# Altium project MB1397.PrjPcb (part 7 of 9)

## Sheet STLink_V3E_SWD.SchDoc: ST-LINK V3 SWD Module
size A3; Date: Not used; ApprovedBy: Not used; CheckedBy: Not used; Author: Not used; CompanyName: STMicroelectronics; DrawnBy: Not used; Engineer: Not used; Organization: Not used; Address1: Not used; Address2: Not used; Address3: Not used; Address4: Not used; DocumentNumber: Not used; Revision: Not used; SheetNumber: 21; SheetTotal: 22; CurrentTime: Not used; CurrentDate: Not used; Time: Not used; DocumentFullPathAndName: Not used; DocumentName: Not used; ModifiedDate: Not used; ImagePath: Not used; ProjectName: Not used; Application_BuildNumber: Not used
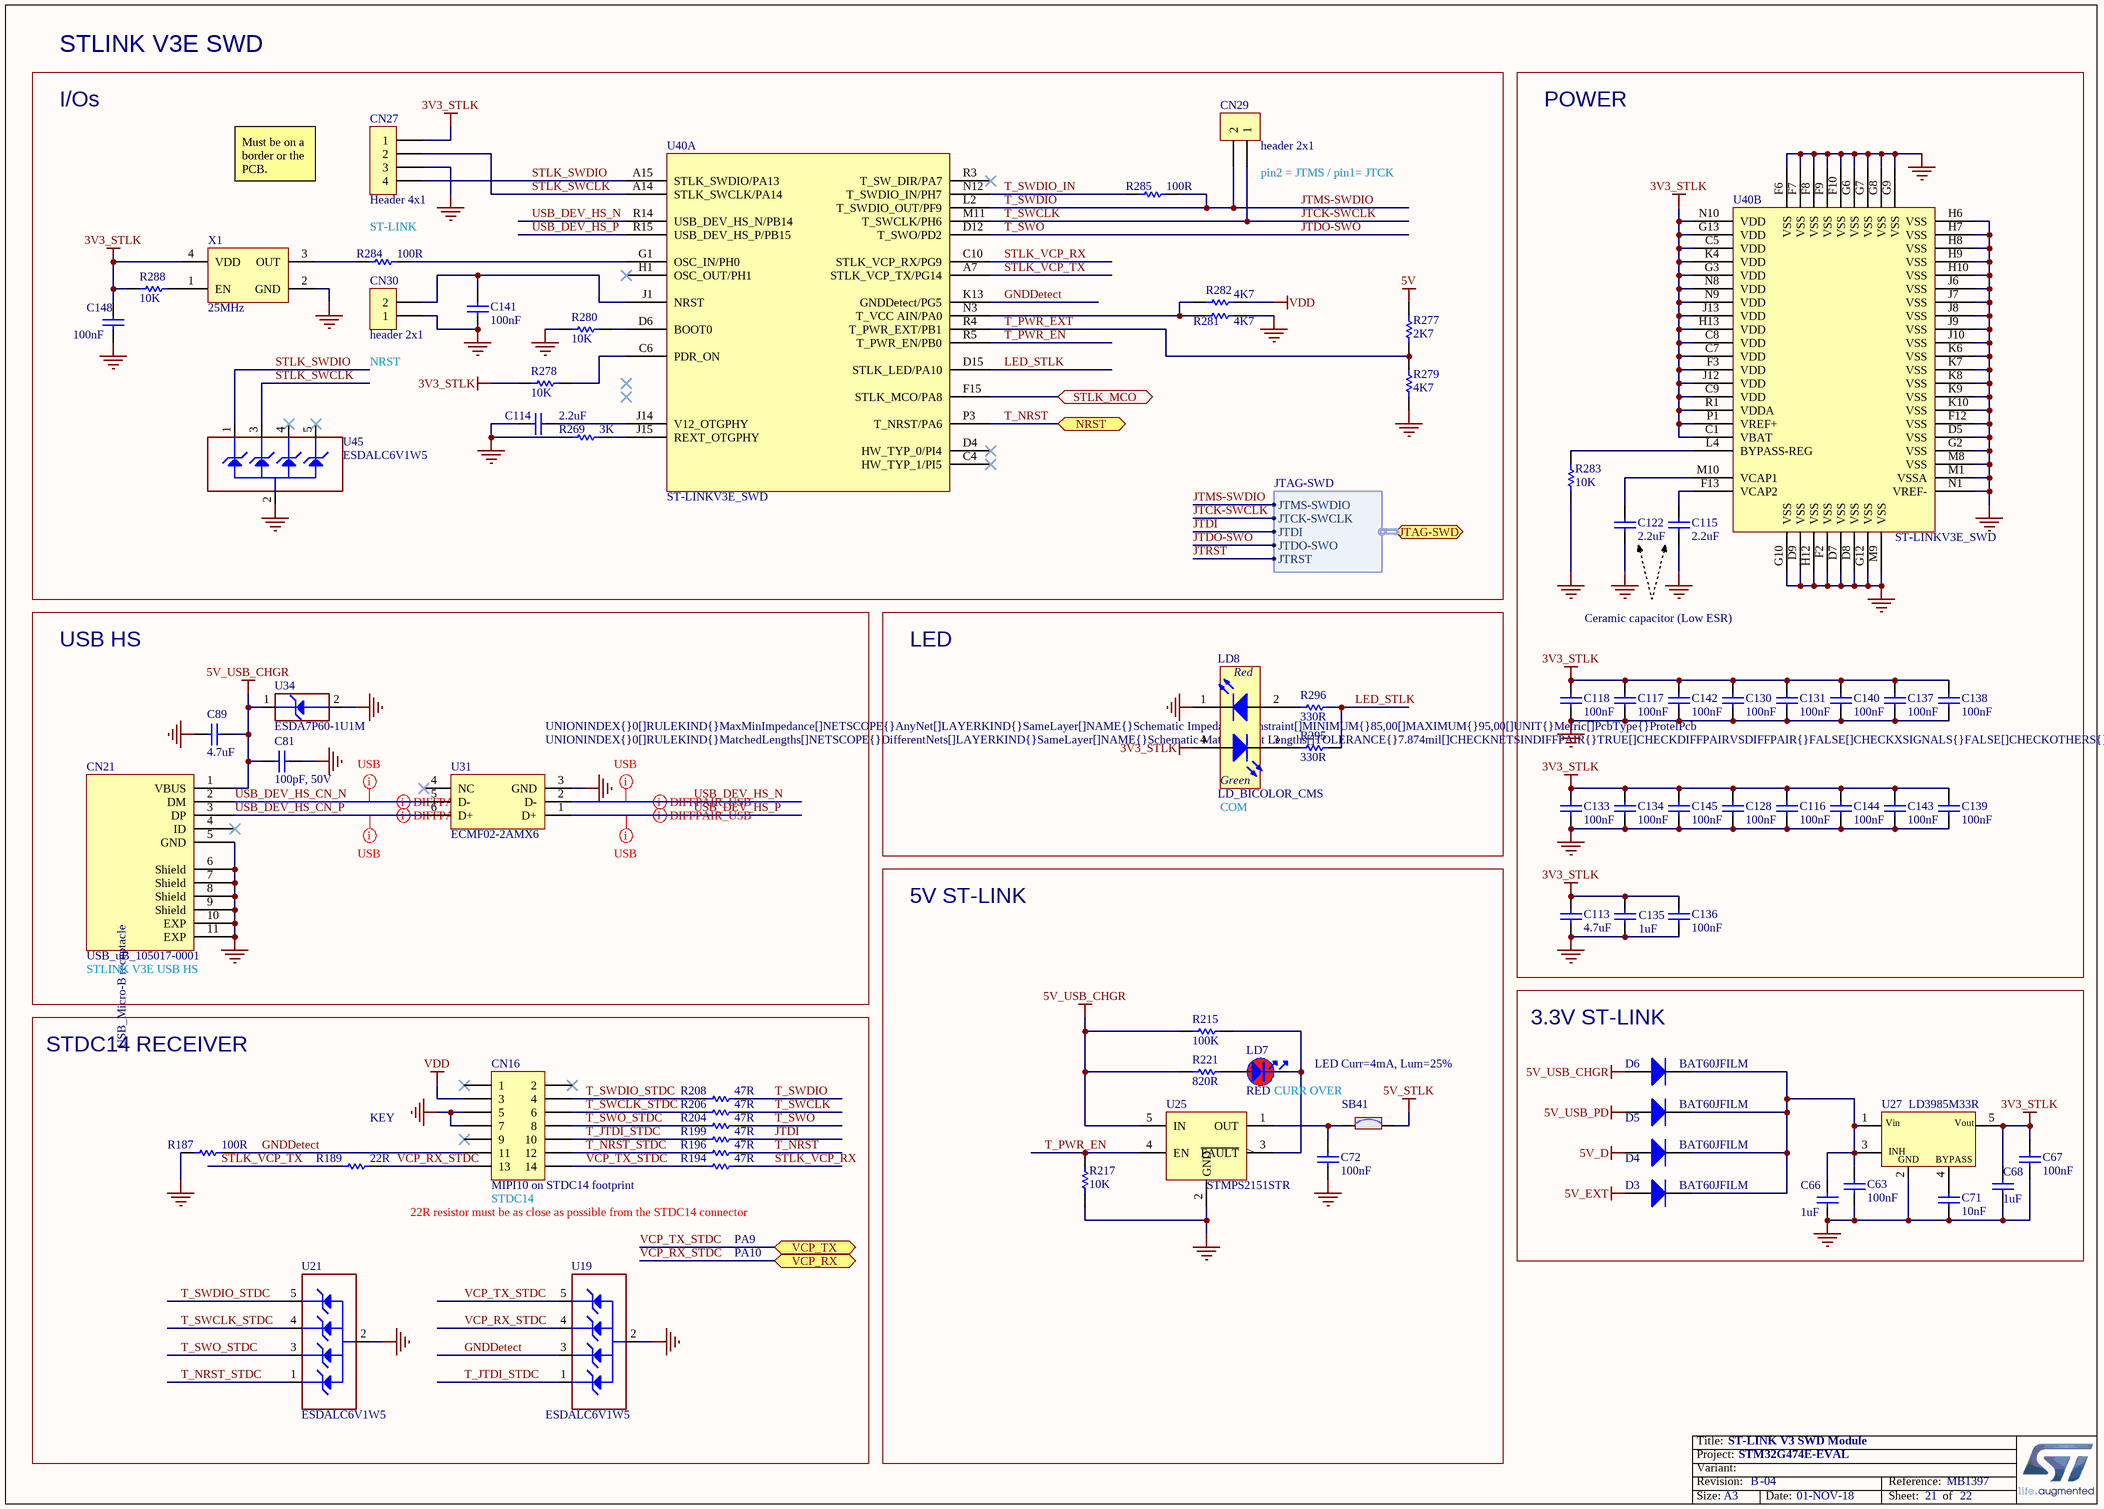
[diagram p16: STLink_V3E_SWD.SchDoc]

### Parts
C63  value 100nF  [C0402]  (hidden comment: Capacitor)
C66  value 1uF  [C0603]  (hidden comment: Capacitor)
C67  value 100nF  [C0603]  (hidden comment: Capacitor)
C68  value 1uF  [C0603]  (hidden comment: Capacitor)
C71  value 10nF  [C0402]  (hidden comment: Capacitor)
C72  value 100nF  [C0402]  (hidden comment: Capacitor)
C81  value 100pF, 50V  [C0603]  (hidden comment: Capacitor)
C89  value 4.7uF  [C0603]  (hidden comment: Capacitor)
C113  value 4.7uF  [C0603]  (hidden comment: Capacitor)
C114  value 2.2uF  [C0603]  (hidden comment: Capacitor)
C115  value 2.2uF  [C1206_H1P15]  (hidden comment: Capacitor)
C116  value 100nF  [C0402]  (hidden comment: Capacitor)
C117  value 100nF  [C0402]  (hidden comment: Capacitor)
C118  value 100nF  [C0402]  (hidden comment: Capacitor)
C122  value 2.2uF  [C1206_H1P15]  (hidden comment: Capacitor)
C128  value 100nF  [C0402]  (hidden comment: Capacitor)
C130  value 100nF  [C0402]  (hidden comment: Capacitor)
C131  value 100nF  [C0402]  (hidden comment: Capacitor)
C133  value 100nF  [C0402]  (hidden comment: Capacitor)
C134  value 100nF  [C0402]  (hidden comment: Capacitor)
C135  value 1uF  [C0603]  (hidden comment: Capacitor)
C136  value 100nF  [C0402]  (hidden comment: Capacitor)
C137  value 100nF  [C0402]  (hidden comment: Capacitor)
C138  value 100nF  [C0402]  (hidden comment: Capacitor)
C139  value 100nF  [C0402]  (hidden comment: Capacitor)
C140  value 100nF  [C0402]  (hidden comment: Capacitor)
C141  value 100nF  [C0402]  (hidden comment: Capacitor)
C142  value 100nF  [C0402]  (hidden comment: Capacitor)
C143  value 100nF  [C0402]  (hidden comment: Capacitor)
C144  value 100nF  [C0402]  (hidden comment: Capacitor)
C145  value 100nF  [C0402]  (hidden comment: Capacitor)
C148  value 100nF  [C0402]  (hidden comment: Capacitor)
CN16  value MIPI10 on STDC14 footprint  [CON_STDC14_Receiver_MEDIUM_WITH_MIPI10_3D]  (hidden comment: Header 7x2)
CN21  value USB_uB_105017-0001  [CON_USBMICROB_MOLEX_105017-0001_H2P90]  (hidden comment: USB_uB_105017.0001)
CN27  Header 4x1  [CON_SAMTEC_TSW-104-07-G-S]
CN29  Header 2x1  [CON_988-JIUBABA_PHFS25-11-02-G0B115-T-1]
CN30  Header 2x1  [CON_988-JIUBABA_PHFS25-11-02-G0B115-T-1]
D3  BAT60JFILM  [DIO_SOD323]
D4  BAT60JFILM  [DIO_SOD323]
D5  BAT60JFILM  [DIO_SOD323]
D6  BAT60JFILM  [DIO_SOD323]
LD7  value RED  [LED_0603_VISHAY_VLMS1300-GS08_RED_1A2K_H0P8]  (hidden comment: LED_red)
LD8  LD_BICOLOR_CMS  [LED_BI-GR_HSMF-A201-A00J1]
R187  value 100R  [R0402]  (hidden comment: Resistor)
R189  value 22R  [R0402]  (hidden comment: Resistor)
R194  value 47R  [R0402]  (hidden comment: Resistor)
R196  value 47R  [R0402]  (hidden comment: Resistor)
R199  value 47R  [R0402]  (hidden comment: Resistor)
R204  value 47R  [R0402]  (hidden comment: Resistor)
R206  value 47R  [R0402]  (hidden comment: Resistor)
R208  value 47R  [R0402]  (hidden comment: Resistor)
R215  value 100K  [R0603]  (hidden comment: Resistor)
R217  value 10K  [R0402]  (hidden comment: Resistor)
R221  value 820R  [R0402]  (hidden comment: Resistor)
R269  value 3K  [R0402]  (hidden comment: Resistor)
R277  value 2K7  [R0402]  (hidden comment: Resistor)
R278  value 10K  [R0402]  (hidden comment: Resistor)
R279  value 4K7  [R0402]  (hidden comment: Resistor)
R280  value 10K  [R0402]  (hidden comment: Resistor)
R281  value 4K7  [R0402]  (hidden comment: Resistor)
R282  value 4K7  [R0402]  (hidden comment: Resistor)
R283  value 10K  [R0402]  (hidden comment: Resistor)
R284  value 100R  [R0402]  (hidden comment: Resistor)
R285  value 100R  [R0402]  (hidden comment: Resistor)
R288  value 10K  [R0402]  (hidden comment: Resistor)
R295  value 330R  [R0603]  (hidden comment: Resistor)
R296  value 330R  [R0603]  (hidden comment: Resistor)
SB41  SB_ON  [SOLDER-BRIDGE_R0603-0R]  (value not drawn)
U19  ESDALC6V1W5  [ESD_SOT323-5L]
U21  ESDALC6V1W5  [ESD_SOT323-5L]
U25  STMPS2151STR  [MOS_SOT23-5L]
U27  LD3985M33R  [REG_SOT23-5L]
U31  ECMF02-2AMX6  [ESD_QFN-6L_1P7X1P5_P050]
U34  value ESDA7P60-1U1M  [ESD_QFN2_1P6X1_P125]  (hidden comment: ESD-TRANSIL)
U40  ST-LINKV3E_SWD  [ICC_UFBGA201_176+25_10X10_P065]  (parts A,B of 2)
U45  ESDALC6V1W5  [ESD_SOT323-5L]
X1  value 25MHz  [OSC_NDK_NZ2520SB_4P]  (hidden comment: OSCILLATOR_4_PINS)

### Blocks framed on the sheet
STLINK V3E SWD: C114 C141 C148 CN27 CN29 CN30 R269 R277-R282 R284 R285 R288 U40 U45 X1
POWER: C113 C115-C118 C122 C128 C130 C131 C133-C140 C142-C145 R283 U40
USB HS: C81 C89 CN21 U31 U34
LED: LD8 R295 R296
5V ST-LINK: C72 LD7 R215 R217 R221 SB41 U25
3.3V ST-LINK: C63 C66-C68 C71 D3-D6 U27
STDC14 RECEIVER: CN16 R187 R189 R194 R196 R199 R204 R206 R208 U19 U21

### Ports
JTAG-SWD (harness JTAG-SWD), NRST, STLK_MCO, VCP_RX, VCP_TX

### Harnesses
JTAG-SWD: JTMS-SWDIO, JTCK-SWCLK, JTDI, JTDO-SWO, JTRST

### Nets
3V3_STLK: C67.2 C68.2 C113.2 C116.2 C117.2 C118.2 C128.2 C130.2 C131.2 C133.2 C134.2 C135.2 C136.2 C137.2 C138.2 C139.2 C140.2 C142.2 C143.2 C144.2 C145.2 C148.2 CN27.1 LD8.4(YellowGreen_anode) R278.1 R288.1 U27.5(Vout) U40.C1(VBAT) U40.C5(VDD) U40.C7(VDD) U40.C8(VDD) U40.C9(VDD) U40.F3(VDD) U40.G3(VDD) U40.G13(VDD) U40.H13(VDD) U40.J12(VDD) U40.J13(VDD) U40.K4(VDD) U40.N8(VDD) U40.N9(VDD) U40.N10(VDD) U40.P1(VREF+) U40.R1(VDDA) X1.4(VDD)
5V: R277.2
5V_D: D4.1(A)
5V_EXT: D3.1(A)
5V_STLK: SB41.2
5V_USB_CHGR: C81.1 C89.2 CN21.1(VBUS) D6.1(A) R215.1 R221.1 U25.5(IN) U34.1(IO1)
5V_USB_PD: D5.1(A)
GND: C63.1 C66.2 C67.1 C68.1 C71.1 C72.1 C81.2 C89.1 C113.1 C114.1 C115.1 C116.1 C117.1 C118.1 C122.1 C128.1 C130.1 C131.1 C133.1 C134.1 C135.1 C136.1 C137.1 C138.1 C139.1 C140.1 C141.1 C142.1 C143.1 C144.1 C145.1 C148.1 CN16.5 CN16.7 CN21.5(GND) CN21.6(Shield) CN21.7(Shield) CN21.8(Shield) CN21.9(Shield) CN21.10(EXP) CN21.11(EXP) CN27.3 CN30.1 LD8.1(RED_cathode) R187.1 R217.1 R269.1 R279.1 R280.1 R281.2 R283.1 U19.2(GND) U21.2(GND) U25.2(GND) U27.2(GND) U31.3(GND) U34.2(GND) U40.D5(VSS) U40.D7(VSS) U40.D8(VSS) U40.D9(VSS) U40.F2(VSS) U40.F6(VSS) U40.F7(VSS) U40.F8(VSS) U40.F9(VSS) U40.F10(VSS) U40.F12(VSS) U40.G2(VSS) U40.G6(VSS) U40.G7(VSS) U40.G8(VSS) U40.G9(VSS) U40.G10(VSS) U40.G12(VSS) U40.H6(VSS) U40.H7(VSS) U40.H8(VSS) U40.H9(VSS) U40.H10(VSS) U40.H12(VSS) U40.J6(VSS) U40.J7(VSS) U40.J8(VSS) U40.J9(VSS) U40.J10(VSS) U40.K6(VSS) U40.K7(VSS) U40.K8(VSS) U40.K9(VSS) U40.K10(VSS) U40.M1(VSSA) U40.M8(VSS) U40.M9(VSS) U40.N1(VREF-) U45.2(GND) X1.2(GND)
VDD: CN16.3 R282.2
GNDDetect: CN16.11 R187.2 U19.3(IO2) U40.K13(GNDDetect/PG5)
JTCK-SWCLK: CN29.1 R206.2 U40.M11(T_SWCLK/PH6) ; port JTAG-SWD.JTCK-SWCLK  [also labelled T_SWCLK]
JTDI: R199.2 ; port JTAG-SWD.JTDI
JTDO-SWO: R204.2 U40.D12(T_SWO/PD2) ; port JTAG-SWD.JTDO-SWO  [also labelled T_SWO]
JTMS-SWDIO: CN29.2 R208.2 R285.2 U40.L2(T_SWDIO_OUT/PF9) ; port JTAG-SWD.JTMS-SWDIO  [also labelled T_SWDIO]
LED_STLK: R295.2 R296.2 U40.D15(STLK_LED/PA10)
STLK_SWCLK: CN27.2 U40.A14(STLK_SWCLK/PA14) U45.3(IO2)
STLK_SWDIO: CN27.4 U40.A15(STLK_SWDIO/PA13) U45.1(IO1)
STLK_VCP_RX: R194.2 U40.C10(STLK_VCP_RX/PG9)
STLK_VCP_TX: R189.1 U40.A7(STLK_VCP_TX/PG14)
T_JTDI_STDC: CN16.10 R199.1 U19.1(IO1)
T_NRST: R196.2 U40.P3(T_NRST/PA6) ; port NRST  [project net NRST]
T_NRST_STDC: CN16.12 R196.1 U21.1(IO1)
T_PWR_EN: R217.2 U25.4(EN) U40.R5(T_PWR_EN/PB0)
T_PWR_EXT: R277.1 R279.2 U40.R4(T_PWR_EXT/PB1)
T_SWCLK_STDC: CN16.6 R206.1 U21.4(IO3)
T_SWDIO_IN: R285.1 U40.N12(T_SWDIO_IN/PH7)
T_SWDIO_STDC: CN16.4 R208.1 U21.5(IO4)
T_SWO_STDC: CN16.8 R204.1 U21.3(IO2)
USB_DEV_HS_CN_N: CN21.2(DM) U31.5(D-)
USB_DEV_HS_CN_P: CN21.3(DP) U31.6(D+)
USB_DEV_HS_N: U31.2(D-) U40.R14(USB_DEV_HS_N/PB14)
USB_DEV_HS_P: U31.1(D+) U40.R15(USB_DEV_HS_P/PB15)
VCP_RX_STDC: CN16.13 R189.2 U19.4(IO3) ; port VCP_RX
VCP_TX_STDC: CN16.14 R194.1 U19.5(IO4) ; port VCP_TX
NetC63_2: C63.2 C66.1 D3.2(K) D4.2(K) D5.2(K) D6.2(K) U27.1(Vin) U27.3(CE)
NetC71_2: C71.2 U27.4(BYPASS)
NetC72_2: C72.2 SB41.1 U25.1(OUT)
NetC114_2: C114.2 U40.J14(V12_OTGPHY)
NetC115_2: C115.2 U40.F13(VCAP2)
NetC122_2: C122.2 U40.M10(VCAP1)
NetC141_2: C141.2 CN30.2 U40.J1(NRST)
NetLD7_1: LD7.1 R221.2
NetLD7_2: LD7.2 R215.2 U25.3(~{FAULT})
NetLD8_2: LD8.2(Red_anode) R296.1
NetLD8_3: LD8.3(YellowGreen_cathode) R295.1
NetR269_2: R269.2 U40.J15(REXT_OTGPHY)
NetR278_2: R278.2 U40.C6(PDR_ON)
NetR280_2: R280.2 U40.D6(BOOT0)
NetR281_1: R281.1 R282.1 U40.N3(T_VCC_AIN/PA0)
NetR283_2: R283.2 U40.L4(BYPASS-REG)
NetR284_1: R284.1 X1.3(OUT)
NetR284_2: R284.2 U40.G1(OSC_IN/PH0)
NetR288_2: R288.2 X1.1(EN)
NetR312_1: U40.F15(STLK_MCO/PA8) ; port STLK_MCO

Not connected (* = marked no-connect by the designer): CN16 1* 2* 9*; CN21 4(ID)*; U31 4(NC)*; U40 C4(HW_TYP_1/PI5)* D4(HW_TYP_0/PI4)* H1(OSC_OUT/PH1)* R3(T_SW_DIR/PA7)*; U45 4(IO3)* 5(IO4)*

### Layout directives
differential pair; rule Impedance Constraint [Min = 85.00    Max = 95.00    ]: USB_DEV_HS_CN_N, USB_DEV_HS_CN_P, USB_DEV_HS_N, USB_DEV_HS_P
rule Undefined; rule Matched Net Lengths [Tolerance = 0.2mm]; rule Impedance Constraint [Min = 85.00    Max = 95.00    ]: USB_DEV_HS_CN_N, USB_DEV_HS_CN_P, USB_DEV_HS_N, USB_DEV_HS_P

### Notes on the sheet
- I/Os
- Must be on a border or the PCB.
- (near CN29) pin2 = JTMS / pin1= JTCK
- ST-LINK
- (near CN30) NRST
- Ceramic capacitor (Low ESR)
- COM
- (near CN21) STLINK V3E USB HS
- (near R189) KEY
- (near LD7) CURR OVER
- LED Curr=4mA, Lum=25%
- 22R resistor must be as close as possible from the STDC14 connector
- (near CN16) STDC14
- PA9
- PA10
- Title:
- Project:
- Size:
- Revision:
- Variant:
- A3
- -
- Date:
- Reference:
- Sheet:
- of
- (in symbol MCD-00028) USB_Micro-B receptacle
- (in symbol MCD-00051) Red; Green
- (in symbol MCD-00086) INH

### Library data of the parts
C63 C72 C116-C118 C128 C130 C131 C133 C134 C136-C145 C148 = MCD-00006: as C157 on sheet Peripherals; Internal_Part_Number: MCD-00006; Status: Released; Package: C0402; ComponentLink1Description: Datasheet; Part_Type: Capacitor; ComponentLink1URL: http://tunmcdsvn.tun.st.com/Component_Datasheet_Library/Trunk/Capacitors/Yageo_Multilayer_Capacitor_X7R_series_100pF_to_22uF
C66 C68 C135 = MCD-00010: as C43 on sheet Peripherals; Internal_Part_Number: MCD-00010; Status: Released; Part_Type: Capacitor; Package: C0603; ComponentLink1Description: Datasheet; ComponentLink1URL: http://tunmcdsvn.tun.st.com/Component_Datasheet_Library/Trunk/Capacitors/Yageo_Multilayer_capacitor_X5R_series_100pF_to_100uF
C67 = MCD-00211: as C13 on sheet Peripherals; Internal_Part_Number: MCD-00211; Status: Released; Package: C0603; ComponentLink1Description: Datasheet; Part_Type: Capacitor; ComponentLink1URL: http://tunmcdsvn.tun.st.com/Component_Datasheet_Library/Trunk/Capacitors/Yageo_Multilayer_Capacitor_X7R_series_100pF_to_22uF
C71 = MCD-00011: Capacitor, MLCC, 10nF, 16V, X7R, 10%, 0402, T=0.5mm; Manufacturer_Part_Number: CC0402KRX7R7BB103; Manufacturer: YAGEO; Provided_By: SUBCO; Initial_Board_Reference: MB1274; Path: ws/MCD_ApplicationBoards/Lists/MCDPARTSdatabase; Item Type: Item; Internal_Part_Number: MCD-00011; Status: Released; Part_Type: Capacitor; Package: C0402; ComponentLink1Description: Datasheet; ComponentLink1URL: http://tunmcdsvn.tun.st.com/Component_Datasheet_Library/Trunk/Capacitors/Yageo_Multilayer_Capacitor_X7R_series_100pF_to_22uF
C81 = MCD-01101: Capacitor,100pF,50V,X7R,10%,0603; Manufacturer_Part_Number: 06035C101JAT4A; Manufacturer: AVX; Provided_By: SUBCO; Initial_Board_Reference: MB1381; Path: ws/MCD_ApplicationBoards/Lists/MCDPARTSdatabase; Item Type: Item; Internal_Part_Number: MCD-01101; Status: Footprint available; Part_Type: Capacitor; Package: C0603; ComponentLink1Description: Datasheet; ComponentLink1URL: http://tunmcdsvn.tun.st.com/Component_Datasheet_Library/Trunk/Capacitors/AVX_Capacitor_X7R-series/AVX_X7R-series.pdf
C89 C113 = MCD-00009: Capacitor, MLCC, 4.7uF, 16V, X5R, 10%, 0603, T=0.8mm; Manufacturer_Part_Number: CC0603KRX5R7BB475; Manufacturer: YAGEO; Provided_By: SUBCO; Initial_Board_Reference: MB1274; Path: ws/MCD_ApplicationBoards/Lists/MCDPARTSdatabase; Item Type: Item; Internal_Part_Number: MCD-00009; Status: Released; Part_Type: Capacitor; Package: C0603; ComponentLink1Description: Datasheet; ComponentLink1URL: http://tunmcdsvn.tun.st.com/Component_Datasheet_Library/Trunk/Capacitors/Yageo_Multilayer_capacitor_X5R_series_100pF_to_100uF
C114 = MCD-00012: Capacitor, MLCC, 2.2uF, 10V, X5R, 10%, 0603, T=0,8mm; Manufacturer_Part_Number: CC0603KRX5R6BB225; Manufacturer: YAGEO; Alternate_Manufacturer_Part_Number: C0603C225K8PACTU; Alternate_Manufacturer: KEMET; Provided_By: SUBCO; Initial_Board_Reference: MB1274; Path: ws/MCD_ApplicationBoards/Lists/MCDPARTSdatabase; Item Type: Item; Internal_Part_Number: MCD-00012; Status: Released; Package: C0603; ComponentLink1Description: Datasheet; Part_Type: Capacitor; ComponentLink1URL: http://tunmcdsvn.tun.st.com/Component_Datasheet_Library/Trunk/Capacitors/Yageo_Multilayer_capacitor_X5R_series_100pF_to_100uF
C115 C122 = MCD-00008: Capacitor, MLCC, 2.2uF, 16V, X7R, 10%, 1206, T=1,15mm; Manufacturer_Part_Number: CC1206KKX7R7BB225; Manufacturer: YAGEO; Alternate_Manufacturer_Part_Number: C1206C225K4RAC; Alternate_Manufacturer: KEMET; Provided_By: SUBCO; Initial_Board_Reference: MB1274; Path: ws/MCD_ApplicationBoards/Lists/MCDPARTSdatabase; Item Type: Item; Internal_Part_Number: MCD-00008; Status: Released; Part_Type: Capacitor; Package: C1206; ComponentLink1Description: Datasheet; ComponentLink1URL: http://tunmcdsvn.tun.st.com/Component_Datasheet_Library/Trunk/Capacitors/Yageo_Multilayer_Capacitor_X7R_series_100pF_to_22uF
CN16 = MCD-01226: Header 5x2, 1.27mm, Dual row, Straight, Surface mount, vertical male connector. 3.05mm lead. Mates with FFSD connector. Footprint compatible with FTSH-107-01-L-DV,-K,-A,-P,-ES (STDC14 MEDIUM); Manufacturer_Part_Number: FTSH-105-01-L-DV-K; Manufacturer: SAMTEC; Provided_By: SUBCO; Initial_Board_Reference: MCD16-052; Path: ws/MCD_ApplicationBoards/Lists/MCDPARTSdatabase; Item Type: Item; Internal_Part_Number: MCD-01226; Status: Released; Part_Type: Connector; ComponentLink1Description: Datasheet; ComponentLink1URL: http://tunmcdsvn.tun.st.com/Component_Datasheet_Library/Trunk/Connectors/Samtec_FTSH_smt_series
CN21 = MCD-00028: USB-MICRO-B, 0.65mm, RA, SMT, Bottom Mount,; Manufacturer_Part_Number: 1050170001; Manufacturer: MOLEX; Part_Type: Connector; Provided_By: SUBCO; Initial_Board_Reference: MB1274; Path: ws/MCD_ApplicationBoards/Lists/MCDPARTSdatabase; Item Type: Item; Internal_Part_Number: MCD-00028; Status: Released; ComponentLink1Description: Datasheet; ComponentLink1URL: http://tunmcdsvn.tun.st.com/Component_Datasheet_Library/Trunk/Connectors/Molex_Connector-USB-microB_105017-0001
CN27 = MCD-00029: Header, 4x1, 2,54mm, VR, TH, Height 5.84mm/2.54mm; Manufacturer_Part_Number: TSW-104-07-x-S; Manufacturer: SAMTEC; Part_Type: Connector; Provided_By: SUBCO; Initial_Board_Reference: MB1274; Path: ws/MCD_ApplicationBoards/Lists/MCDPARTSdatabase; Item Type: Item; Internal_Part_Number: MCD-00029; Value: Header 4x1; Status: Released; ComponentLink1Description: Datasheet; ComponentLink1URL: http://tunmcdsvn.tun.st.com/Component_Datasheet_Library/Trunk/Connectors/Samtec_TSW-HTSW-series
CN29 CN30 = MCD-00314: Header, 2x1, 2.54mm, VR, TH, Height 6mm/3mm; Part_Type: Connector; Manufacturer_Part_Number: PHFS25-11-02-G0B115-T-1; Manufacturer: JIUBABA; Provided_By: SUBCO; Initial_Board_Reference: MB1311; Path: ws/MCD_ApplicationBoards/Lists/MCDPARTSdatabase; Item Type: Item; Internal_Part_Number: MCD-00314; Value: header 2x1; Status: Released; ComponentLink1Description: Datasheet; ComponentLink1URL: http://tunmcdsvn.tun.st.com/Component_Datasheet_Library/Trunk/Connectors/Jiubaba_PHFS25_11XXXXXXXXXX
D3-D6 = MCD-00034: Manufacturer: STMICROELECTRONICS; Part_Type: Diode; BMS_Part_Number: 9151097; Provided_By: SUBCO with ST control; Initial_Board_Reference: MB1274; Path: ws/MCD_ApplicationBoards/Lists/MCDPARTSdatabase; Item Type: Item; Internal_Part_Number: MCD-00034; Value: BAT60JFILM; Status: Released; Manufacturer_Part_Number: BAT60JFILM; ComponentLink1Description: Datasheet; ComponentLink1URL: http://tunmcdsvn.tun.st.com/Component_Datasheet_Library/Trunk/Diodes/STM_Diode_BAT60JFILM-SOD323
LD7 = MCD-00587: as LD3 on sheet Peripherals; Internal_Part_Number: MCD-00587; Status: Released; ComponentLink1Description: Datasheet; ComponentLink1URL: http://tunmcdsvn.tun.st.com/Component_Datasheet_Library/Trunk/Display/VISHAY_LED_RED_VLMS1300-GS08; Order_Code_Digikey: VLMS1300-GS08CT-ND; Order_Code_Farnell: 2078728; Package: LED 0603
LD8 = MCD-00051: LED Bicolor; Part_Type: Display; Manufacturer_Part_Number: HSMF-A201-A00J1; Manufacturer: AVAGO TECHNOLOGIES; Alternate_Manufacturer_Part_Number: LE-RGW35280; Alternate_Manufacturer: EVERLUCK; Provided_By: SUBCO; Initial_Board_Reference: MB1274; Path: ws/MCD_ApplicationBoards/Lists/MCDPARTSdatabase; Item Type: Item; Internal_Part_Number: MCD-00051; Value: LD_BICOLOR_CMS; Status: Released; ComponentLink1Description: Datasheet; ComponentLink1URL: http://tunmcdsvn.tun.st.com/Component_Datasheet_Library/Trunk/Display/Avago_LED-SMC_HSMx-A2xx-02Feb2012
R187 R284 R285 = MCD-00119: Resistor,100R,0402,1%,1/16W; Manufacturer_Part_Number: RC0402FR-07100RL; Manufacturer: YAGEO; Provided_By: SUBCO; Initial_Board_Reference: MB1262; Path: ws/MCD_ApplicationBoards/Lists/MCDPARTSdatabase; Item Type: Item; Internal_Part_Number: MCD-00119; Status: Released; Part_Type: Resistor; ComponentLink1Description: Datasheet; Package: R0402; ComponentLink1URL: http://tunmcdsvn.tun.st.com/Component_Datasheet_Library/Trunk/Resistors/Yageo_Resistor_RC0402-series
R189 = MCD-00189: Resistor,22R,0402,1%,1/16W; Manufacturer_Part_Number: RC0402FR-0722RL; Manufacturer: YAGEO; Provided_By: SUBCO; Initial_Board_Reference: MBxxxx; Path: ws/MCD_ApplicationBoards/Lists/MCDPARTSdatabase; Item Type: Item; Internal_Part_Number: MCD-00189; Status: Released; Part_Type: Resistor; Package: R0402; ComponentLink1Description: Datasheet; ComponentLink1URL: http://tunmcdsvn.tun.st.com/Component_Datasheet_Library/Trunk/Resistors/Yageo_Resistor_RC0402-series
R194 R196 R199 R204 R206 R208 = MCD-00481: Resistor,47R,0402,1%,1/16W; Internal_Part_Number: MCD-00481
R215 = MCD-00223: Resistor,100K,0603,1%,1/10W; Manufacturer_Part_Number: RC0603FR-07100KL; Manufacturer: YAGEO; Provided_By: SUBCO; Initial_Board_Reference: MB1319; Path: ws/MCD_ApplicationBoards/Lists/MCDPARTSdatabase; Item Type: Item; Internal_Part_Number: MCD-00223; Status: Released; Part_Type: Resistor; Package: R0603; ComponentLink1Description: Datasheet; ComponentLink1URL: http://tunmcdsvn.tun.st.com/Component_Datasheet_Library/Trunk/Resistors/Yageo_Resistor_RC0603-series
R217 R278 R280 R283 R288 = MCD-00053: as R294 on sheet Peripherals; Internal_Part_Number: MCD-00053; Status: Released; ComponentLink1Description: Datasheet; Part_Type: Resistor; Package: R0402; ComponentLink1URL: http://tunmcdsvn.tun.st.com/Component_Datasheet_Library/Trunk/Resistors/Yageo_Resistor_RC0402-series
R221 = MCD-00527: Resistor,820R,0402,1%,1/16W; Manufacturer_Part_Number: RC0402FR-07820RL; Manufacturer: YAGEO; Provided_By: SUBCO; Initial_Board_Reference: MBxxxx; Path: ws/MCD_ApplicationBoards/Lists/MCDPARTSdatabase; Item Type: Item; Internal_Part_Number: MCD-00527; Status: Released; Part_Type: Resistor; Package: R0402; ComponentLink1Description: Datasheet; ComponentLink1URL: http://tunmcdsvn.tun.st.com/Component_Datasheet_Library/Trunk/Resistors/Yageo_Resistor_RC0402-series
R269 = MCD-00185: Resistor,3K,0402,1%,1/16W; Manufacturer_Part_Number: RC0402FR-073KL; Manufacturer: YAGEO; Provided_By: SUBCO; Initial_Board_Reference: MBxxxx; Path: ws/MCD_ApplicationBoards/Lists/MCDPARTSdatabase; Item Type: Item; Internal_Part_Number: MCD-00185; Status: Released; ComponentLink1Description: Datasheet; Part_Type: Resistor; Package: R0402; ComponentLink1URL: http://tunmcdsvn.tun.st.com/Component_Datasheet_Library/Trunk/Resistors/Yageo_Resistor_RC0402-series
R277 = MCD-00055: Resistor,2K7,0402,1%,1/16W; Manufacturer_Part_Number: RC0402FR-072K7L; Manufacturer: YAGEO; Provided_By: SUBCO; Initial_Board_Reference: MB1274; Path: ws/MCD_ApplicationBoards/Lists/MCDPARTSdatabase; Item Type: Item; Internal_Part_Number: MCD-00055; Status: Released; ComponentLink1Description: Datasheet; Part_Type: Resistor; Package: R0402; ComponentLink1URL: http://tunmcdsvn.tun.st.com/Component_Datasheet_Library/Trunk/Resistors/Yageo_Resistor_RC0402-series
R279 R281 R282 = MCD-00065: as R16 on sheet Peripherals; Internal_Part_Number: MCD-00065; Status: Released; ComponentLink1Description: Datasheet; Alternate_Manufacturer: YAGEO; Part_Type: Resistor; Package: R0402; ComponentLink1URL: http://tunmcdsvn.tun.st.com/Component_Datasheet_Library/Trunk/Resistors/Yageo_Resistor_RC0402-series
R295 R296 = MCD-00197: Resistor,330R,0603,1%,1/10W; Manufacturer_Part_Number: RC0603FR-07330RL; Manufacturer: YAGEO; BMS_Part_Number: 9129729; Provided_By: SUBCO; Initial_Board_Reference: MBxxxx; Path: ws/MCD_ApplicationBoards/Lists/MCDPARTSdatabase; Item Type: Item; Internal_Part_Number: MCD-00197; Status: Released; ComponentLink1Description: Datasheet; Part_Type: Resistor; Package: R0603; ComponentLink1URL: http://tunmcdsvn.tun.st.com/Component_Datasheet_Library/Trunk/Resistors/Yageo_Resistor_RC0603-series
SB41 = MCD-00071: as SB1 on sheet Peripherals; Internal_Part_Number: MCD-00071; Status: Released; ComponentLink1Description: Datasheet; Package: SB0603; ComponentLink1URL: http://tunmcdsvn.tun.st.com/Component_Datasheet_Library/Trunk/Resistors/Yageo_Resistor_RC0603-series
U19 U21 = MCD-00136: Dual Transil array for ESD protection; Part_Type: Diode; Manufacturer: STMICROELECTRONICS; BMS_Part_Number: 9151112; Provided_By: SUBCO with ST control; Initial_Board_Reference: MB1262; Path: ws/MCD_ApplicationBoards/Lists/MCDPARTSdatabase; Item Type: Item; Internal_Part_Number: MCD-00136; Value: ESDALC6V1W5; Status: Released; Manufacturer_Part_Number: ESDALC6V1W5; ComponentLink1Description: Datasheet; ComponentLink1URL: http://tunmcdsvn.tun.st.com/Component_Datasheet_Library/Trunk/Diodes/STM_ESD_ESDALC6V1W5
U25 = MCD-00159: 500mA, Enhanced single channel power switches with active high enable pin; Part_Type: IC; Manufacturer: STMICROELECTRONICS; Alternate_Manufacturer_Part_Number: TPS2051C; Alternate_Manufacturer: TEXAS INSTRUMENTS; BMS_Part_Number: 9159009; Provided_By: SUBCO with ST control; Initial_Board_Reference: MB1264; Path: ws/MCD_ApplicationBoards/Lists/MCDPARTSdatabase; Item Type: Item; Internal_Part_Number: MCD-00159; Value: STMPS2151STR; Status: Released; Manufacturer_Part_Number: STMPS2151STR; ComponentLink1Description: Datasheet; ComponentLink1URL: http://tunmcdsvn.tun.st.com/Component_Datasheet_Library/Trunk/IC/STM_PWR-Switch_STMPS2151STR
U27 = MCD-00086: Ultra low drop-low noise BiCMOS voltage, regulators low ESR capacitors compatible; Manufacturer: STMICROELECTRONICS; Part_Type: IC; BMS_Part_Number: 9176161; Provided_By: SUBCO with ST control; Initial_Board_Reference: MB1274; Path: ws/MCD_ApplicationBoards/Lists/MCDPARTSdatabase; Item Type: Item; Internal_Part_Number: MCD-00086; Value: LD3985M33R; Status: Released; Manufacturer_Part_Number: LD3985M33R; ComponentLink1Description: Datasheet; ComponentLink1URL: http://tunmcdsvn.tun.st.com/Component_Datasheet_Library/Trunk/IC/STM_LDO_LD3985
U31 = MCD-00649: Common mode filter with ESD protection for USB 2.0 interface; Part_Type: Diode; Manufacturer: STMICROELECTRONICS; BMS_Part_Number: 9151138; Provided_By: SUBCO with ST control; Initial_Board_Reference: MB1248; Path: ws/MCD_ApplicationBoards/Lists/MCDPARTSdatabase; Item Type: Item; Internal_Part_Number: MCD-00649; Value: ECMF02-2AMX6; Status: Released; Manufacturer_Part_Number: ECMF02-2AMX6; ComponentLink1Description: Datasheet; ComponentLink1URL: http://tunmcdsvn.tun.st.com/Component_Datasheet_Library/Trunk/Diodes/STM_ESD_ECMF02-2AMX6
U34 = MCD-00251: High power transient voltage suppressor, 7V breakdown; Part_Type: Diode; Manufacturer: STMICROELECTRONICS; BMS_Part_Number: 9179042; Provided_By: SUBCO with ST control; Initial_Board_Reference: MB1311; Path: ws/MCD_ApplicationBoards/Lists/MCDPARTSdatabase; Item Type: Item; Internal_Part_Number: MCD-00251; Status: Released; Manufacturer_Part_Number: ESDA7P60-1U1M; ComponentLink1Description: Datasheet; ComponentLink1URL: http://tunmcdsvn.tun.st.com/Component_Datasheet_Library/Trunk/Diodes/STM_ESD_ESDA7P60-1U1M
U40 = MCD-00596: STM32F723IEK  (STM32F7) BGA176; Part_Type: IC; Manufacturer_Part_Number: STM32F723IEK6; Manufacturer: STMICROELECTRONICS; BMS_Part_Number: 9175300; Provided_By: SUBCO with ST control; Initial_Board_Reference: MB1331; Path: ws/MCD_ApplicationBoards/Lists/MCDPARTSdatabase; Item Type: Item; Internal_Part_Number: MCD-00596; Value: ST-LINKV3E_SWD; Status: Released; ComponentLink1Description: Datasheet; ComponentLink1URL: http://tunmcdsvn.tun.st.com/Component_Datasheet_Library/Trunk/IC/BGA176+25L_10x10x0.6_pitch0.65
U45 = MCD-00136: Dual Transil array for ESD protection; Manufacturer: STMICROELECTRONICS; Part_Type: Diode; BMS_Part_Number: 9151112; Provided_By: SUBCO with ST control; Initial_Board_Reference: MB1262; Path: ws/MCD_ApplicationBoards/Lists/MCDPARTSdatabase; Item Type: Item; Internal_Part_Number: MCD-00136; Value: ESDALC6V1W5; Manufacturer_Part_Number: ESDALC6V1W5; ComponentLink1Description: Datasheet; Status: Released; ComponentLink1URL: http://tunmcdsvn.tun.st.com/Component_Datasheet_Library/Trunk/Diodes/STM_ESD_ESDALC6V1W5
X1 = MCD-00597: Oscillator 25.00Mhz, -+50PPM, 3.3V, Temp -55 to +125°C; Manufacturer_Part_Number: NZ2520SB 25MHz END4869B; Manufacturer: NDK; Alternate_Manufacturer_Part_Number: KC2520B25.0000C10E00; Alternate_Manufacturer: AVX CORP/KYOCERA CORP; Part_Type: Crystal_Osc; BMS_Part_Number: 9157031; Provided_By: ST; Initial_Board_Reference: MB1331; Path: ws/MCD_ApplicationBoards/Lists/MCDPARTSdatabase; Item Type: Item; Internal_Part_Number: MCD-00597; Status: Released; ComponentLink1Description: Datasheet; ComponentLink1URL: http://tunmcdsvn.tun.st.com/Component_Datasheet_Library/Trunk/Crystal_Osc/NDK_OSCILLATOR_NZ2520SB; Order_Code_Digikey: 478-4780-1-ND

## Sheet ExtensionConnector.SchDoc: Extension Connectors
size A4; Date: Not used; ApprovedBy: Not used; CheckedBy: Not used; Author: Not used; CompanyName: STMicroelectronics; DrawnBy: Not used; Engineer: Not used; Organization: Not used; Address1: Not used; Address2: Not used; Address3: Not used; Address4: Not used; DocumentNumber: Not used; Revision: Not used; SheetNumber: 17; SheetTotal: 22; CurrentTime: Not used; CurrentDate: Not used; Time: Not used; DocumentFullPathAndName: Not used; DocumentName: Not used; ModifiedDate: Not used; ImagePath: Not used; ProjectName: Not used; Application_BuildNumber: Not used
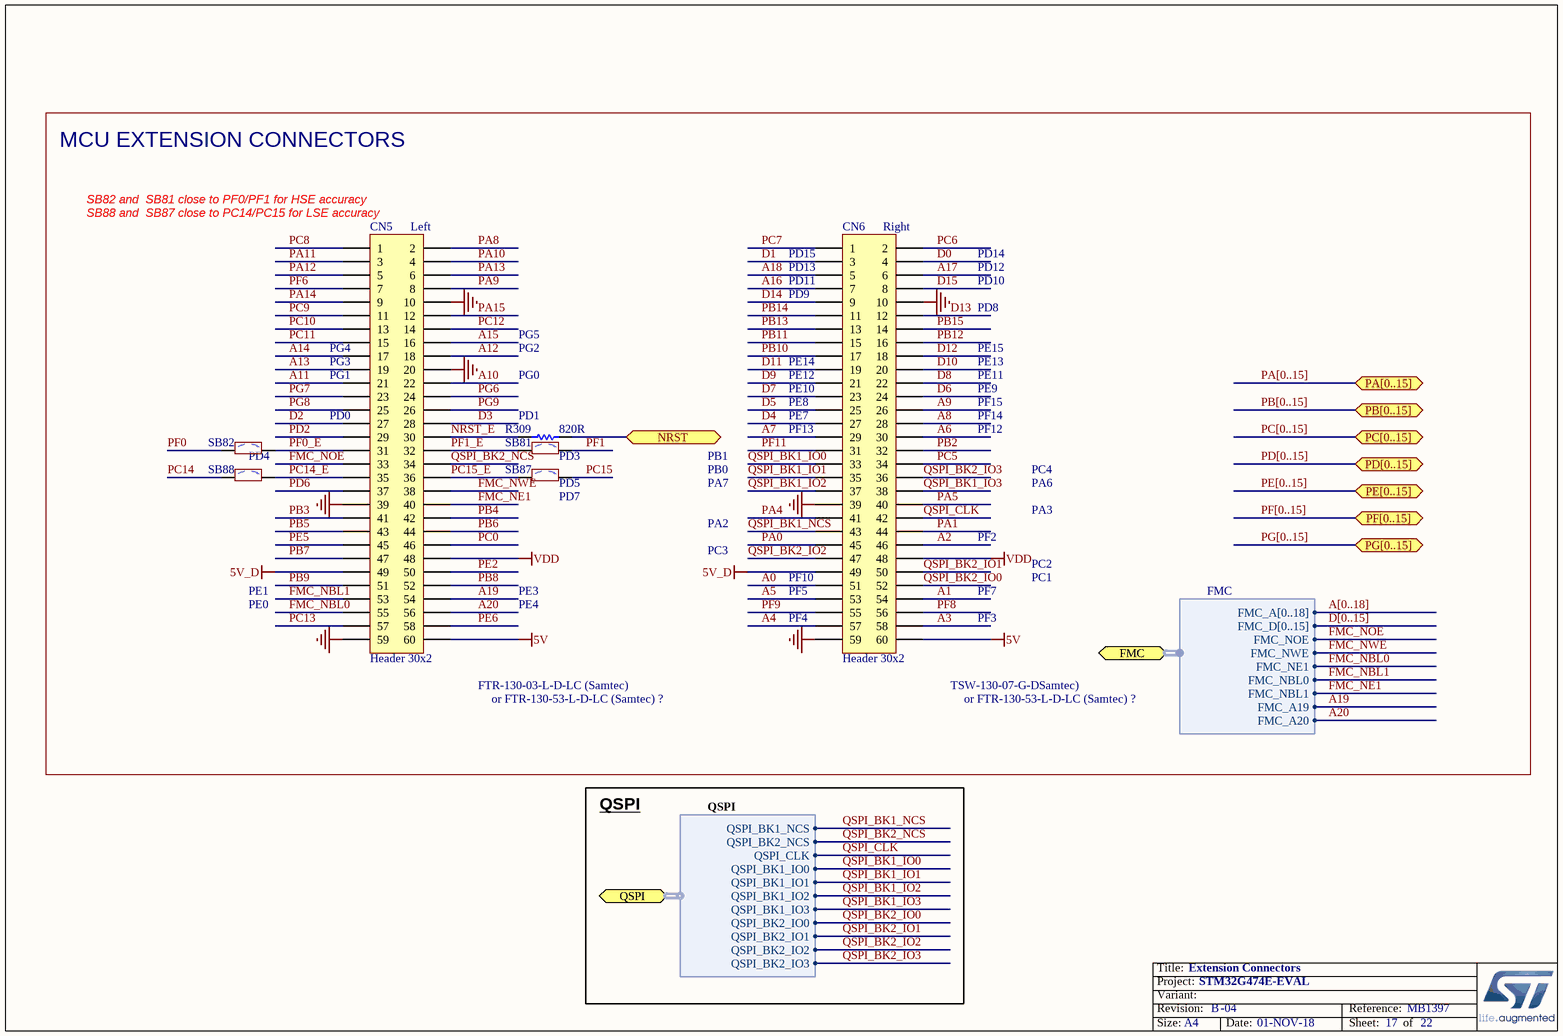
[diagram p17: ExtensionConnector.SchDoc]

### Parts
CN5  Header 30x2  [CON_SAMTEC_FTR-130-53-L-D-LC]
CN6  Header 30x2  [CON_SAMTEC_FTR-130-53-L-D-LC]
R309  value 820R  [R0402]  (hidden comment: Resistor)
SB81  SB_OFF  [SOLDER-BRIDGE_R0603-0R]  (value not drawn)
SB82  SB_OFF  [SOLDER-BRIDGE_R0603-0R]  (value not drawn)
SB87  SB_OFF  [SOLDER-BRIDGE_R0603-0R]  (value not drawn)
SB88  SB_OFF  [SOLDER-BRIDGE_R0603-0R]  (value not drawn)

### Ports
FMC (harness FMC), NRST, PA[0..15], PB[0..15], PC[0..15], PD[0..15], PE[0..15], PF[0..15], PG[0..15], QSPI (harness QSPI)

### Harnesses
FMC: FMC_NWE, FMC_NOE, FMC_NE1, FMC_A[0..18], FMC_D[0..15], FMC_NBL0, FMC_NBL1, FMC_A19, FMC_A20
QSPI: QSPI_BK1_IO1, QSPI_BK1_IO0, QSPI_CLK, QSPI_BK1_NCS, QSPI_BK1_IO2, QSPI_BK1_IO3, QSPI_BK2_IO1, QSPI_BK2_IO0, QSPI_BK2_IO2, QSPI_BK2_IO3, QSPI_BK2_NCS

### Nets
5V: CN5.60 CN6.60
5V_D: CN5.49 CN6.49
GND: CN5.10 CN5.20 CN5.39 CN5.59 CN6.10 CN6.39 CN6.59
VDD: CN5.48 CN6.48
A0: CN6.51
A1: CN6.54
A2: CN6.46
A3: CN6.58
A4: CN6.57
A5: CN6.53
A6: CN6.30
A7: CN6.29
A8: CN6.28
A9: CN6.26
A10: CN5.22
A11: CN5.21
A12: CN5.18
A13: CN5.19
A14: CN5.17
A15: CN5.16
A16: CN6.7
A17: CN6.6
A18: CN6.5
A19: CN5.54 ; port FMC.FMC_A19
A20: CN5.56 ; port FMC.FMC_A20
D0: CN6.4
D1: CN6.3
D2: CN5.27
D3: CN5.28
D4: CN6.27
D5: CN6.25
D6: CN6.24
D7: CN6.23
D8: CN6.22
D9: CN6.21
D10: CN6.20
D11: CN6.19
D12: CN6.18
D13: CN6.12
D14: CN6.9
D15: CN6.8
FMC_NBL0: CN5.55 ; port FMC.FMC_NE1
FMC_NBL1: CN5.53 ; port FMC.FMC_NBL0
FMC_NE1: CN5.40 ; port FMC.FMC_NBL1
FMC_NOE: CN5.33 ; port FMC.FMC_NOE
FMC_NWE: CN5.38 ; port FMC.FMC_NWE
NRST: R309.2 ; port NRST
NRST_E: CN5.30 R309.1
PA0: CN6.45
PA1: CN6.44
PA4: CN6.41
PA5: CN6.40
PA8: CN5.2
PA9: CN5.8
PA10: CN5.4
PA11: CN5.3
PA12: CN5.5
PA13: CN5.6
PA14: CN5.9
PA15: CN5.12
PB2: CN6.32
PB3: CN5.41
PB4: CN5.42
PB5: CN5.43
PB6: CN5.44
PB7: CN5.47
PB8: CN5.52
PB9: CN5.51
PB10: CN6.17
PB11: CN6.15
PB12: CN6.16
PB13: CN6.13
PB14: CN6.11
PB15: CN6.14
PC0: CN5.46
PC5: CN6.34
PC6: CN6.2
PC7: CN6.1
PC8: CN5.1
PC9: CN5.11
PC10: CN5.13
PC11: CN5.15
PC12: CN5.14
PC13: CN5.57
PC14: SB88.1
PC14_E: CN5.35 SB88.2
PC15: SB87.2
PC15_E: CN5.36 SB87.1
PD2: CN5.29
PD6: CN5.37
PE2: CN5.50
PE5: CN5.45
PE6: CN5.58
PF0: SB82.1
PF0_E: CN5.31 SB82.2
PF1: SB81.2
PF1_E: CN5.32 SB81.1
PF6: CN5.7
PF8: CN6.56
PF9: CN6.55
PF11: CN6.31
PG6: CN5.24
PG7: CN5.23
PG8: CN5.25
PG9: CN5.26
QSPI_BK1_IO0: CN6.33 ; port QSPI.QSPI_BK1_IO0
QSPI_BK1_IO1: CN6.35 ; port QSPI.QSPI_BK1_IO1
QSPI_BK1_IO2: CN6.37 ; port QSPI.QSPI_BK1_IO2
QSPI_BK1_IO3: CN6.38 ; port QSPI.QSPI_BK1_IO3
QSPI_BK1_NCS: CN6.43 ; port QSPI.QSPI_BK1_NCS
QSPI_BK2_IO0: CN6.52 ; port QSPI.QSPI_BK2_IO0
QSPI_BK2_IO1: CN6.50 ; port QSPI.QSPI_BK2_IO1
QSPI_BK2_IO2: CN6.47 ; port QSPI.QSPI_BK2_IO2
QSPI_BK2_IO3: CN6.36 ; port QSPI.QSPI_BK2_IO3
QSPI_BK2_NCS: CN5.34 ; port QSPI.QSPI_BK2_NCS
QSPI_CLK: CN6.42 ; port QSPI.QSPI_CLK

### Buses and harness runs
bus A[0..18]
bus D[0..15]
bus PA[0..15] = port PA[0..15]
bus PB[0..15] = port PB[0..15]
bus PC[0..15] = port PC[0..15]
bus PD[0..15] = port PD[0..15]
bus PE[0..15] = port PE[0..15]
bus PF[0..15] = port PF[0..15]
bus PG[0..15] = port PG[0..15]

### Notes on the sheet
- MCU EXTENSION CONNECTORS
- (near CN5) SB82 and  SB81 close to PF0/PF1 for HSE accuracy
- (near CN5) SB88 and  SB87 close to PC14/PC15 for LSE accuracy
- (near CN5) Left
- (near CN6) Right
- (near CN6) PD9
- (near CN6) PD11
- (near CN6) PD13
- (near CN6) PD15
- PD8
- PD10
- PD12
- PD14
- (near CN5) PG1
- (near CN5) PG3
- (near CN5) PG4
- PG0
- PG2
- PG5
- (near CN6) PE12
- (near CN6) PE14
- PE11
- PE13
- PE15
- (near CN5) PD0
- (near R309) PD1
- (near CN6) PE8
- (near CN6) PE10
- (near CN6) PF13
- (near CN6) PE7
- PE9
- PF12
- PF14
- PF15
- (near SB82) PD4
- (near SB87) PD5
- (near SB87) PD7
- (near SB81) PD3
- PB0
- PB1
- PA7
- PC4
- PA3
- PA6
- PC3
- PA2
- (near CN6) PF10
- PF2
- PC1
- PC2
- PE0
- PE1
- PE3
- PE4
- (near CN6) PF4
- (near CN6) PF5
- PF3
- PF7
- (near CN5) FTR-130-03-L-D-LC (Samtec)
- or FTR-130-53-L-D-LC (Samtec) ?
- (near CN6) TSW-130-07-G-DSamtec)
- QSPI
- Title:
- Project:
- Size:
- Revision:
- Variant:
- A4
- -
- Date:
- Reference:
- Sheet:
- of

### Library data of the parts
CN5 CN6 = MCD-00576: Header 30x2, 1.27mm, VR, CMS, Height 7.24mm; Part_Type: Connector; Manufacturer_Part_Number: FTR-130-53-L-D-LC; Manufacturer: SAMTEC; Alternate_Manufacturer_Part_Number: P1039-2*30MGF-089-1A; Alternate_Manufacturer: JIUBABA; Provided_By: SUBCO; Initial_Board_Reference: MB1331; Path: ws/MCD_ApplicationBoards/Lists/MCDPARTSdatabase; Item Type: Item; Internal_Part_Number: MCD-00576; Value: Header 30x2; Status: Checked; ComponentLink1Description: Datasheet; ComponentLink1URL: http://tunmcdsvn.tun.st.com/Component_Datasheet_Library/Trunk/Connectors/Samtec_FTR_smt_series
R309 = MCD-00527: as R221 on sheet STLink_V3E_SWD; Internal_Part_Number: MCD-00527; Status: Released; ComponentLink1Description: Datasheet; Part_Type: Resistor; Package: R0402; ComponentLink1URL: http://tunmcdsvn.tun.st.com/Component_Datasheet_Library/Trunk/Resistors/Yageo_Resistor_RC0402-series
SB81 SB82 SB87 SB88 = MCD-00072: Solder Bridge OFF; Part_Type: Mechanical; Manufacturer_Part_Number: RC0603JR-070RL; Manufacturer: YAGEO; Provided_By: SUBCO; Initial_Board_Reference: MB1274; Path: ws/MCD_ApplicationBoards/Lists/MCDPARTSdatabase; Item Type: Item; Internal_Part_Number: MCD-00072; Status: Released; ComponentLink1Description: Datasheet; Package: SB0603; ComponentLink1URL: http://tunmcdsvn.tun.st.com/Component_Datasheet_Library/Trunk/Resistors/Yageo_Resistor_RC0603-series

## Sheet USB_PD.SchDoc: USB_PD
size A4; Date: Not used; ApprovedBy: Not used; CheckedBy: Not used; Author: Not used; CompanyName: STMicroelectronics; DrawnBy: Not used; Engineer: Not used; Organization: Not used; Address1: Not used; Address2: Not used; Address3: Not used; Address4: Not used; DocumentNumber: Not used; Revision: Not used; SheetNumber: 5; SheetTotal: 22; CurrentTime: Not used; CurrentDate: Not used; Time: Not used; DocumentFullPathAndName: Not used; DocumentName: Not used; ModifiedDate: Not used; ImagePath: Not used; ProjectName: Not used; Application_BuildNumber: Not used
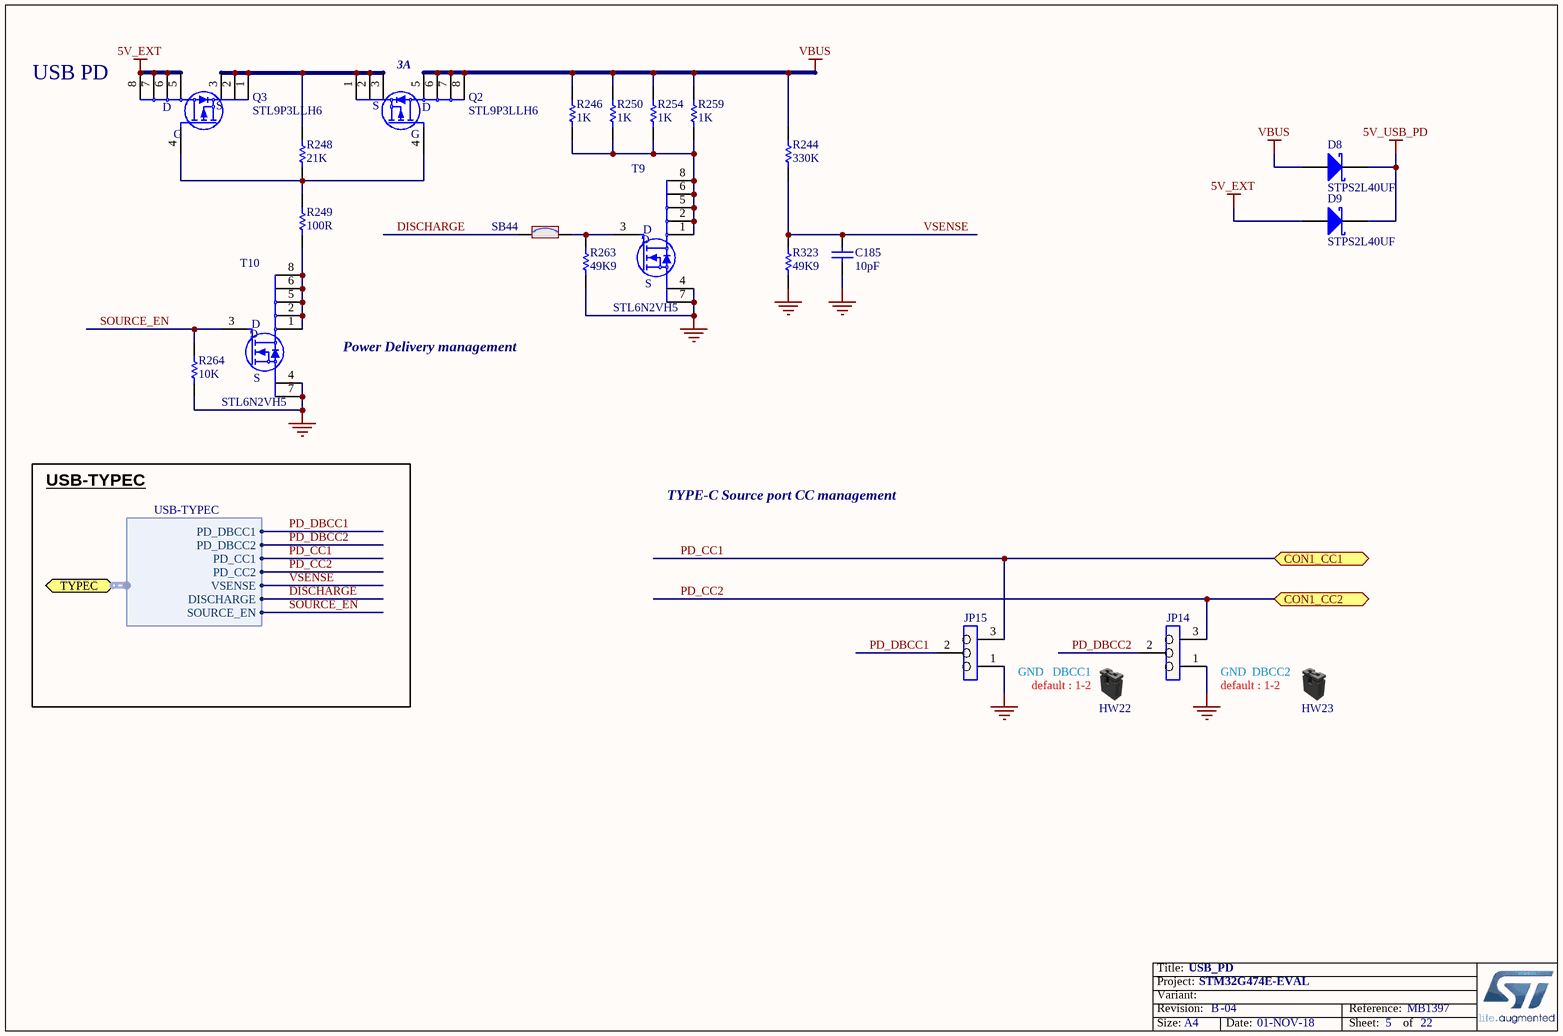
[diagram p18: USB_PD.SchDoc]

### Parts
C185  value 10pF  [C0603]  (hidden comment: Capacitor)
D8  STPS2L40UF  [DIO_SMB-FLAT_1A_2K]
D9  STPS2L40UF  [DIO_SMB-FLAT_1A_2K]
HW22  Shunt Black 2.54mm  (value not drawn)  (mechanical)
HW23  Shunt Black 2.54mm  (value not drawn)  (mechanical)
JP14  Jumper_Header 3x1  [CON_SAMTEC_TSW-103-07-F-S]  (value not drawn)
JP15  Jumper_Header 3x1  [CON_SAMTEC_TSW-103-07-F-S]  (value not drawn)
Q2  STL9P3LLH6  [MOS_POWERFLAT_3P3X3P3_P065]
Q3  STL9P3LLH6  [MOS_POWERFLAT_3P3X3P3_P065]
R244  value 330K  [R0603]  (hidden comment: Resistor)
R246  value 1K  [R0603]  (hidden comment: Resistor)
R248  value 21K  [R0603]  (hidden comment: Resistor)
R249  value 100R  [R0603]  (hidden comment: Resistor)
R250  value 1K  [R0603]  (hidden comment: Resistor)
R254  value 1K  [R0603]  (hidden comment: Resistor)
R259  value 1K  [R0603]  (hidden comment: Resistor)
R263  value 49K9  [R0603]  (hidden comment: Resistor)
R264  value 10K  [R0603]  (hidden comment: Resistor)
R323  value 49K9  [R0603]  (hidden comment: Resistor)
SB44  SB_ON  [SOLDER-BRIDGE_R0603-0R]  (value not drawn)
T9  STL6N2VH5  [MOS_POWERFLAT_2X2_P065]
T10  STL6N2VH5  [MOS_POWERFLAT_2X2_P065]

### Ports
CON1_CC1, CON1_CC2, TYPEC (harness USB-TYPEC)

### Harnesses
USB-TYPEC: PD_DBCC1, PD_DBCC2, PD_CC1, PD_CC2, VSENSE, DISCHARGE, SOURCE_EN

### Nets
5V_EXT: D9.1(A) Q3.5(D) Q3.6(D) Q3.7(D) Q3.8(D)
5V_USB_PD: D8.2(K) D9.2(K)
GND: C185.1 JP14.1 JP15.1 R263.1 R264.1 R323.1 T9.4(S) T9.7(S) T10.4(S) T10.7(S)
VBUS: D8.1(A) Q2.5(D) Q2.6(D) Q2.7(D) Q2.8(D) R244.2 R246.2 R250.2 R254.2 R259.2
DISCHARGE: SB44.1 ; port TYPEC.DISCHARGE
PD_CC1: JP15.3 ; port CON1_CC1, port TYPEC.PD_CC1  [project net CON1_CC1]
PD_CC2: JP14.3 ; port CON1_CC2, port TYPEC.PD_CC2  [project net CON1_CC2]
PD_DBCC1: JP15.2 ; port TYPEC.PD_DBCC1
PD_DBCC2: JP14.2 ; port TYPEC.PD_DBCC2
SOURCE_EN: R264.2 T10.3(G) ; port TYPEC.SOURCE_EN
VSENSE: C185.2 R244.1 R323.2 ; port TYPEC.VSENSE
NetQ2_1: Q2.1(S) Q2.2(S) Q2.3(S) Q3.1(S) Q3.2(S) Q3.3(S) R248.2
NetQ2_4: Q2.4(G) Q3.4(G) R248.1 R249.2
NetR246_1: R246.1 R250.1 R254.1 R259.1 T9.1(D) T9.2(D) T9.5(D) T9.6(D) T9.8(D)
NetR249_1: R249.1 T10.1(D) T10.2(D) T10.5(D) T10.6(D) T10.8(D)
NetR263_2: R263.2 SB44.2 T9.3(G)

### Notes on the sheet
- (near Q3) USB PD
- (near Q2) 3A
- Power Delivery management
- USB-TYPEC
- TYPE-C Source port CC management
- (near HW22) GND   DBCC1
- (near HW22) default : 1-2
- (near HW23) default : 1-2
- (near HW23) GND  DBCC2
- Title:
- Project:
- Size:
- Revision:
- Variant:
- A4
- -
- Date:
- Reference:
- Sheet:
- of

### Library data of the parts
C185 = MCD-00637: Capacitor, MLCC, 10pF, 50V, NPO, 5%, 0603, T=0,8mm; Manufacturer_Part_Number: CC0603JRNPO9BN100; Manufacturer: YAGEO; Provided_By: SUBCO; Initial_Board_Reference: MB1319; Path: ws/MCD_ApplicationBoards/Lists/MCDPARTSdatabase; Item Type: Item; Internal_Part_Number: MCD-00637; Status: Released; Part_Type: Capacitor; Package: C0603; ComponentLink1Description: Datasheet; ComponentLink1URL: http://tunmcdsvn.tun.st.com/Component_Datasheet_Library/Trunk/Capacitors/Yageo_Capacitor_NP0_16V-to-50V
D8 D9 = MCD-01087: Low drop power Schottky rectifier(2A, 40V, 0.34V); Part_Type: Diode; Manufacturer: STMICROELECTRONICS; BMS_Part_Number: 9151009; Provided_By: SUBCO with ST control; Initial_Board_Reference: MB1381; Remark: Anode = pin 1; Path: ws/MCD_ApplicationBoards/Lists/MCDPARTSdatabase; Item Type: Item; Internal_Part_Number: MCD-01087; Value: STPS2L40UF; Status: Footprint available; Manufacturer_Part_Number: STPS2L40UF; Package: SMBflat; ComponentLink1Description: Datasheet; ComponentLink1URL: http://tunmcdsvn.tun.st.com/Component_Datasheet_Library/Trunk/Diodes/STM_Schottky_STPS2L40UF/STM_Schottky_STPS2L40UF.pdf
HW22 HW23 = MCD-00043: SHUNT 2.54mm BLACK; Part_Type: Mechanical; Manufacturer_Part_Number: SNT-100-BK-G; Manufacturer: SAMTEC; Provided_By: SUBCO; Initial_Board_Reference: MB1274; Value: SNT-100-BK-G; Path: ws/MCD_ApplicationBoards/Lists/MCDPARTSdatabase; Item Type: Item; Internal_Part_Number: MCD-00043; Status: Released; ComponentLink1Description: Datasheet; ComponentLink1URL: http://tunmcdsvn.tun.st.com/Component_Datasheet_Library/Trunk/Connectors/Samtec_Shunt_Jumper_SNT100
JP14 JP15 = MCD-00111: Header, 3x1, 2,54mm, VR, TH, Height 5.84mm/2.54mm; Part_Type: Connector; Manufacturer_Part_Number: TSW-103-07-F-S; Manufacturer: SAMTEC; Provided_By: SUBCO; Initial_Board_Reference: MB1262; Path: ws/MCD_ApplicationBoards/Lists/MCDPARTSdatabase; Item Type: Item; Internal_Part_Number: MCD-00111; Value: Header 3x1; Status: Released; ComponentLink1Description: Datasheet; ComponentLink1URL: http://tunmcdsvn.tun.st.com/Component_Datasheet_Library/Trunk/Connectors/Samtec_TSW-HTSW-series
Q2 Q3 = MCD-01126: Power Mosfet, P-channel,VDS -30V,RDS 12mohm typ,ID -9A; Part_Type: IC; Manufacturer: STMICROELECTRONICS; Provided_By: SUBCO with ST control; Initial_Board_Reference: MB1272; Remark: footprint MOS_POWERFLAT_3P3X3P3_P065 pin 5-8 for solder mask and paste mask profile is same as top layer; Path: ws/MCD_ApplicationBoards/Lists/MCDPARTSdatabase; Item Type: Item; Internal_Part_Number: MCD-01126; Value: STL9P3LLH6; Status: Checked; Manufacturer_Part_Number: STL9P3LLH6; Package: PowerFLAT 3.3x3.3; ComponentLink1Description: Datasheet; ComponentLink1URL: http://tunmcdsvn.tun.st.com/Component_Datasheet_Library/Trunk/IC/STM_POWER_MOSFET_P_STL9P3LLH6
R244 = MCD-00458: Resistor,330K,0603,1%,1/10W; Manufacturer_Part_Number: RC0603FR-07330KL; Manufacturer: YAGEO; Provided_By: SUBCO; Initial_Board_Reference: MBxxxx; Path: ws/MCD_ApplicationBoards/Lists/MCDPARTSdatabase; Item Type: Item; Internal_Part_Number: MCD-00458; Status: Released; Part_Type: Resistor; Package: R0603; ComponentLink1Description: Datasheet; ComponentLink1URL: http://tunmcdsvn.tun.st.com/Component_Datasheet_Library/Trunk/Resistors/Yageo_Resistor_RC0603-series
R246 R250 R254 R259 = MCD-00070: Resistor,1K,0603,1%,1/10W; Manufacturer_Part_Number: RC0603FR-071KL; Manufacturer: YAGEO; Provided_By: SUBCO; Initial_Board_Reference: MB1274; Path: ws/MCD_ApplicationBoards/Lists/MCDPARTSdatabase; Item Type: Item; Internal_Part_Number: MCD-00070; Status: Released; Part_Type: Resistor; Package: R0603; ComponentLink1Description: Datasheet; ComponentLink1URL: http://tunmcdsvn.tun.st.com/Component_Datasheet_Library/Trunk/Resistors/Yageo_Resistor_RC0603-series
R248 = MCD-01189: Resistor,21K,0603,1%,1/10W; Manufacturer_Part_Number: RC0603FR-0721KL; Manufacturer: YAGEO; Provided_By: SUBCO; Initial_Board_Reference: MB1397; Path: ws/MCD_ApplicationBoards/Lists/MCDPARTSdatabase; Item Type: Item; Internal_Part_Number: MCD-01189; Status: Released; Part_Type: Resistor; Package: R0603; ComponentLink1Description: Datasheet; ComponentLink1URL: http://tunmcdsvn.tun.st.com/Component_Datasheet_Library/Trunk/Resistors/Yageo_Resistor_RC0603-series
R249 = MCD-00224: Resistor,100R,0603,1%,1/10W; Manufacturer_Part_Number: RC0603FR-07100RL; Manufacturer: YAGEO; Provided_By: SUBCO; Initial_Board_Reference: MB1319; Path: ws/MCD_ApplicationBoards/Lists/MCDPARTSdatabase; Item Type: Item; Internal_Part_Number: MCD-00224; Status: Released; Part_Type: Resistor; Package: R0603; ComponentLink1Description: Datasheet; ComponentLink1URL: http://tunmcdsvn.tun.st.com/Component_Datasheet_Library/Trunk/Resistors/Yageo_Resistor_RC0603-series
R263 R323 = MCD-01171: Resistor,49K9,0603,1%; Manufacturer_Part_Number: RC0603FR-0749K9L; Manufacturer: YAGEO; Provided_By: SUBCO; Initial_Board_Reference: MB1397; Path: ws/MCD_ApplicationBoards/Lists/MCDPARTSdatabase; Item Type: Item; Internal_Part_Number: MCD-01171; Status: Released; Part_Type: Resistor; Package: R0603; ComponentLink1Description: Datasheet; ComponentLink1URL: http://tunmcdsvn.tun.st.com/Component_Datasheet_Library/Trunk/Resistors/Yageo_Resistor_RC0603-series/
R264 = MCD-00220: as R176 on sheet Peripherals; Internal_Part_Number: MCD-00220; Status: Released; Part_Type: Resistor; Package: R0603; ComponentLink1Description: Datasheet; ComponentLink1URL: http://tunmcdsvn.tun.st.com/Component_Datasheet_Library/Trunk/Resistors/Yageo_Resistor_RC0603-series
SB44 = MCD-00071: as SB1 on sheet Peripherals; Internal_Part_Number: MCD-00071; Status: Released; ComponentLink1Description: Datasheet; Package: SB0603; ComponentLink1URL: http://tunmcdsvn.tun.st.com/Component_Datasheet_Library/Trunk/Resistors/Yageo_Resistor_RC0603-series
T9 T10 = MCD-01028: as T1 on sheet Peripherals; Internal_Part_Number: MCD-01028; Value: STL6N2VH5; Status: Checked; Manufacturer_Part_Number: STL6N2VH5; Package: PowerFLAT 2x2; ComponentLink1Description: Datasheet; ComponentLink1URL: http://tunmcdsvn.tun.st.com/Component_Datasheet_Library/Trunk/IC/STM_POWER_MOSFET_N_STL6N2VH5

## Sheet Debug connector.SchDoc: Debug connector
size A4; Date: Not used; ApprovedBy: Not used; CheckedBy: Not used; Author: Not used; CompanyName: STMicroelectronics; DrawnBy: Not used; Engineer: Not used; Organization: Not used; Address1: Not used; Address2: Not used; Address3: Not used; Address4: Not used; DocumentNumber: Not used; Revision: Not used; SheetNumber: 18; SheetTotal: 22; CurrentTime: Not used; CurrentDate: Not used; Time: Not used; DocumentFullPathAndName: Not used; DocumentName: Not used; ModifiedDate: Not used; ImagePath: Not used; ProjectName: Not used; Application_BuildNumber: Not used
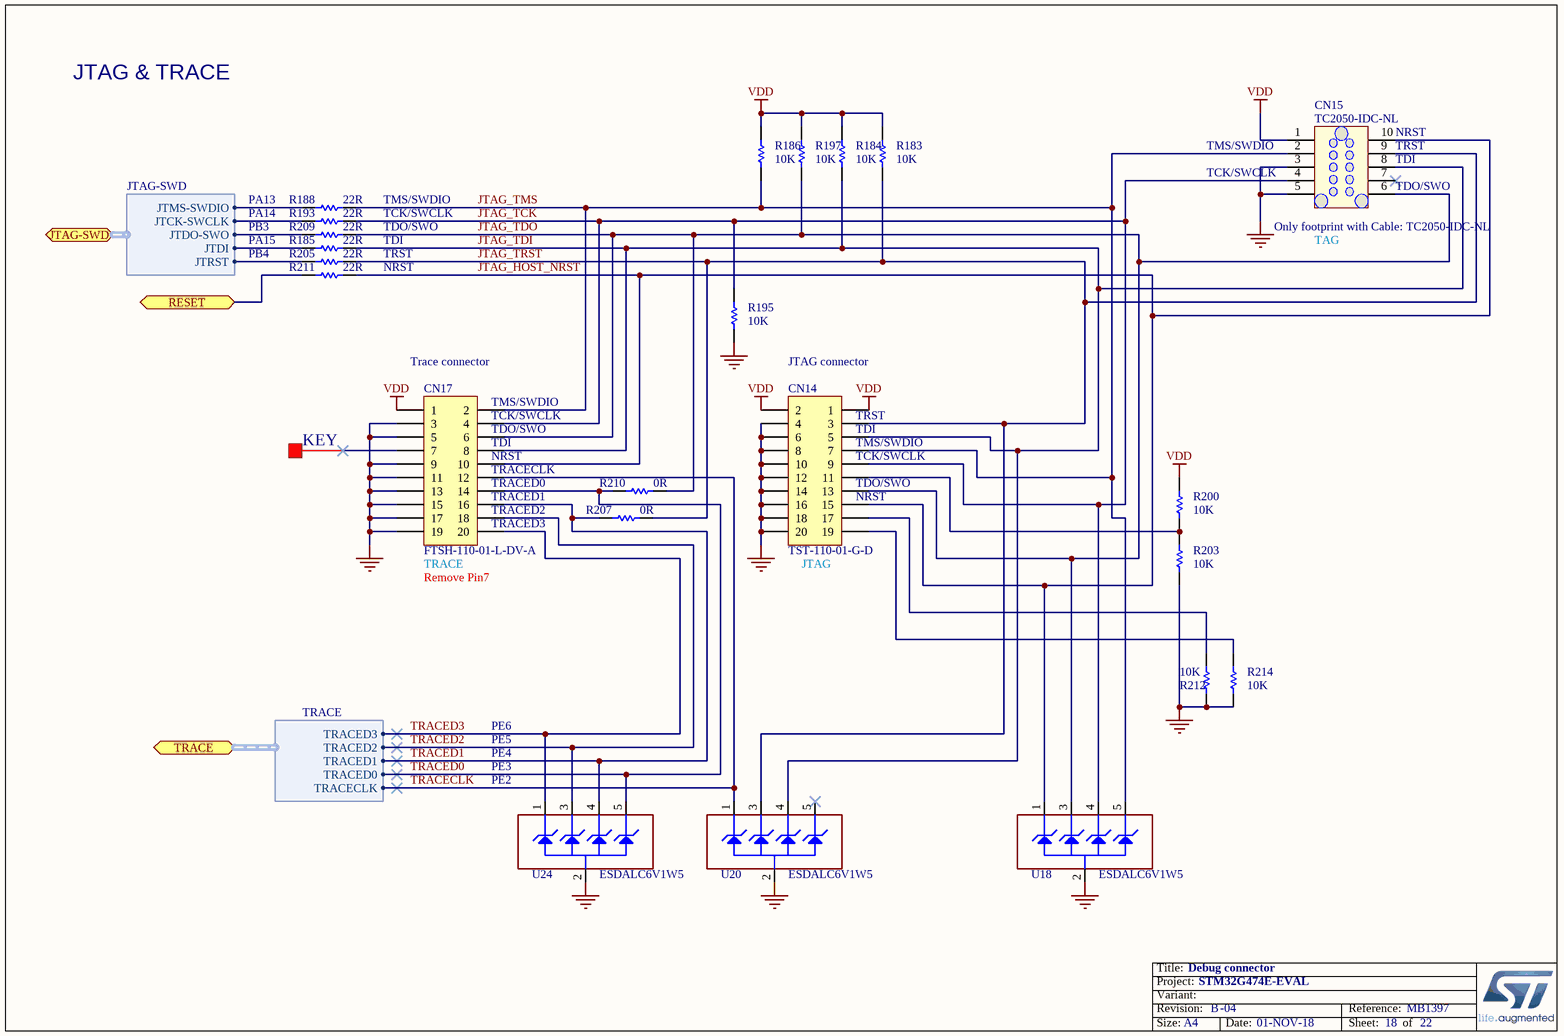
[diagram p19: Debug connector.SchDoc]

### Parts
CN14  value TST-110-01-G-D  [CON_CVILUX_CH87-20-2-V-1-00]  (hidden comment: Header 10x2)
CN15  value TC2050-IDC-NL  [CON_TAG-C_TC2050-IDC-NL]  (hidden comment: Tag-10-C)
CN17  value FTSH-110-01-L-DV-A  [CON_SAMTEC_FTSH-110-01-L-DV-A]  (hidden comment: Header 10x2)
R183  value 10K  [R0402]  (hidden comment: Resistor)
R184  value 10K  [R0402]  (hidden comment: Resistor)
R185  value 22R  [R0402]  (hidden comment: Resistor)
R186  value 10K  [R0402]  (hidden comment: Resistor)
R188  value 22R  [R0402]  (hidden comment: Resistor)
R193  value 22R  [R0402]  (hidden comment: Resistor)
R195  value 10K  [R0402]  (hidden comment: Resistor)
R197  value 10K  [R0402]  (hidden comment: Resistor)
R200  value 10K  [R0402]  (hidden comment: Resistor)
R203  value 10K  [R0402]  (hidden comment: Resistor)
R205  value 22R  [R0402]  (hidden comment: Resistor)
R207  value 0R  [R0402]  (hidden comment: Resistor)
R209  value 22R  [R0402]  (hidden comment: Resistor)
R210  value 0R  [R0402]  (hidden comment: Resistor)
R211  value 22R  [R0402]  (hidden comment: Resistor)
R212  value 10K  [R0402]  (hidden comment: Resistor)
R214  value 10K  [R0402]  (hidden comment: Resistor)
U18  ESDALC6V1W5  [ESD_SOT323-5L]
U20  ESDALC6V1W5  [ESD_SOT323-5L]
U24  ESDALC6V1W5  [ESD_SOT323-5L]

### Ports
JTAG-SWD (harness JTAG-SWD), RESET, TRACE (harness TRACE)

### Harnesses
TRACE: TRACECLK, TRACED0, TRACED1, TRACED2, TRACED3
JTAG-SWD: JTMS-SWDIO, JTCK-SWCLK, JTDI, JTDO-SWO, JTRST

### Nets
GND: CN14.4 CN14.6 CN14.8 CN14.10 CN14.12 CN14.14 CN14.16 CN14.18 CN14.20 CN15.3 CN15.5 CN17.3 CN17.5 CN17.9 CN17.11 CN17.13 CN17.15 CN17.17 CN17.19 R195.1 R203.1 R212.1 R214.1 U18.2(GND) U20.2(GND) U24.2(GND)
VDD: CN14.1 CN14.2 CN15.1 CN17.1 R183.2 R184.2 R186.2 R197.2 R200.2
JTAG_HOST_NRST: CN14.15 CN15.10 CN17.10 R211.1 U18.1(IO1)
JTAG_TCK: CN14.9 CN15.4 CN17.4 R193.1 R195.2 U18.4(IO3)
JTAG_TDI: CN14.5 CN15.8 CN17.8 R184.1 R185.1 U20.4(IO3)
JTAG_TDO: CN14.13 CN15.6 CN17.6 R197.1 R209.1 R210.2 U18.3(IO2)
JTAG_TMS: CN14.7 CN15.2 CN17.2 R186.1 R188.1 U18.5(IO4)
JTAG_TRST: CN14.3 CN15.9 R183.1 R205.1 R207.2 U20.3(IO2)
JTCK-SWCLK: R193.2 ; port JTAG-SWD.JTCK-SWCLK
JTDI: R185.2 ; port JTAG-SWD.JTDI
JTDO-SWO: R209.2 ; port JTAG-SWD.JTDO-SWO
JTMS-SWDIO: R188.2 ; port JTAG-SWD.JTMS-SWDIO
JTRST: R205.2 ; port JTAG-SWD.JTRST
TRACECLK: CN17.12 U20.1(IO1) ; port TRACE.TRACECLK
TRACED0: CN17.14 R210.1 U24.5(IO4) ; port TRACE.TRACED0
TRACED1: CN17.16 R207.1 U24.4(IO3) ; port TRACE.TRACED1
TRACED2: CN17.18 U24.3(IO2) ; port TRACE.TRACED2
TRACED3: CN17.20 U24.1(IO1) ; port TRACE.TRACED3
NetCN14_11: CN14.11 R200.1 R203.2
NetCN14_17: CN14.17 R212.2
NetCN14_19: CN14.19 R214.2
NetR211_2: R211.2 ; port RESET

Not connected (* = marked no-connect by the designer): CN15 7*; CN17 7*; U20 5(IO4)*

### Notes on the sheet
- JTAG & TRACE
- (near CN15) TMS/SWDIO
- (near CN15) TCK/SWCLK
- (near CN15) TDI
- (near CN15) NRST
- (near CN15) TRST
- PA13
- PA14
- PB3
- PA15
- TMS/SWDIO
- TCK/SWCLK
- TDO/SWO
- TDI
- (near CN15) Only footprint with Cable: TC2050-IDC-NL
- (near CN15) TAG
- (near CN15) TDO/SWO
- PB4
- TRST
- NRST
- (near CN17) Trace connector
- JTAG connector
- KEY
- (near CN17) TMS/SWDIO
- (near CN17) TCK/SWCLK
- (near CN17) TDO/SWO
- (near CN17) TDI
- (near CN14) TRST
- (near CN14) TDI
- (near CN14) TMS/SWDIO
- (near CN17) NRST
- (near CN17) TRACECLK
- (near CN17) TRACED0
- (near CN17) TRACED1
- (near CN17) TRACED2
- (near CN14) TCK/SWCLK
- (near CN14) TDO/SWO
- (near CN14) NRST
- (near CN17) Remove Pin7
- (near CN17) TRACE
- (near CN17) TRACED3
- (near CN14) JTAG
- PE6
- PE5
- PE4
- PE3
- (near U24) PE2
- Title:
- Project:
- Size:
- Revision:
- Variant:
- A4
- -
- Date:
- Reference:
- Sheet:
- of

### Library data of the parts
CN14 = MCD-01058: Header, 2.54mm, 10x2, VR, TH, Height 9.1mm/3,1mm; Part_Type: Connector; Manufacturer: SAMTEC; Alternate_Manufacturer_Part_Number: CH87-20-2-V-1-00; Alternate_Manufacturer: CVILUX; Provided_By: SUBCO; Initial_Board_Reference: MB1331; Path: ws/MCD_ApplicationBoards/Lists/MCDPARTSdatabase; Item Type: Item; Internal_Part_Number: MCD-01058; Status: Released; Manufacturer_Part_Number: TST-110-01-G-D; ComponentLink1Description: Datasheet; ComponentLink1URL: http://tunmcdsvn.tun.st.com/Component_Datasheet_Library/Trunk/Connectors/Samtec_TST-series/
CN15 = MCD-00031: Tag_Connector Header, 10x2, No legs; Manufacturer_Part_Number: TC2050-IDC-NL-FP; Manufacturer: TAG-CONNECT LLC; Provided_By: SUBCO; Initial_Board_Reference: MB1274; Path: ws/MCD_ApplicationBoards/Lists/MCDPARTSdatabase; Item Type: Item; Internal_Part_Number: MCD-00031; Status: Released; Part_Type: Connector; ComponentLink1Description: Datasheet; ComponentLink1URL: http://tunmcdsvn.tun.st.com/Component_Datasheet_Library/Trunk/Connectors/TAG_Connector_TC2050-IDC-NLFP
CN17 = MCD-01561: Header 10x2, 1.27mm, VR, CMS, Height 3.05mm with alignment pin; Part_Type: Connector; Manufacturer: SAMTEC; Provided_By: SUBCO; Initial_Board_Reference: MB1397; Path: ws/MCD_ApplicationBoards/Lists/MCDPARTSdatabase; Item Type: Item; Remark: new part FTSH-110-01-L-DV-A to replace MCD-00557 footprint; Internal_Part_Number: MCD-01561; Status: New; Manufacturer_Part_Number: FTSH-110-01-L-DV-A; ComponentLink1Description: Datasheet; ComponentLink1URL: http://tunmcdsvn.tun.st.com/Component_Datasheet_Library/Trunk/Connectors/Samtec_FTSH_smt_series
R183 R184 R186 R195 R197 R200 R203 R212 R214 = MCD-00053: as R294 on sheet Peripherals; Internal_Part_Number: MCD-00053; ComponentLink1Description: Datasheet; Status: Released; Part_Type: Resistor; Package: R0402; ComponentLink1URL: http://tunmcdsvn.tun.st.com/Component_Datasheet_Library/Trunk/Resistors/Yageo_Resistor_RC0402-series
R185 R188 R193 R205 R209 R211 = MCD-00189: as R189 on sheet STLink_V3E_SWD; Internal_Part_Number: MCD-00189; ComponentLink1Description: Datasheet; Status: Released; Part_Type: Resistor; Package: R0402; ComponentLink1URL: http://tunmcdsvn.tun.st.com/Component_Datasheet_Library/Trunk/Resistors/Yageo_Resistor_RC0402-series
R207 R210 = MCD-00052: as R1 on sheet Peripherals; Internal_Part_Number: MCD-00052; Status: Released; Part_Type: Resistor; Package: R0402; ComponentLink1Description: Datasheet; ComponentLink1URL: http://tunmcdsvn.tun.st.com/Component_Datasheet_Library/Trunk/Resistors/Yageo_Resistor_RC0402-series
U18 U20 U24 = MCD-00136: as U45 on sheet STLink_V3E_SWD; Internal_Part_Number: MCD-00136; Value: ESDALC6V1W5; Manufacturer_Part_Number: ESDALC6V1W5; ComponentLink1Description: Datasheet; Status: Released; ComponentLink1URL: http://tunmcdsvn.tun.st.com/Component_Datasheet_Library/Trunk/Diodes/STM_ESD_ESDALC6V1W5